# Altium schematic sheet Power.SchDoc
size A3; SheetNumber: 4; SheetTotal: 7
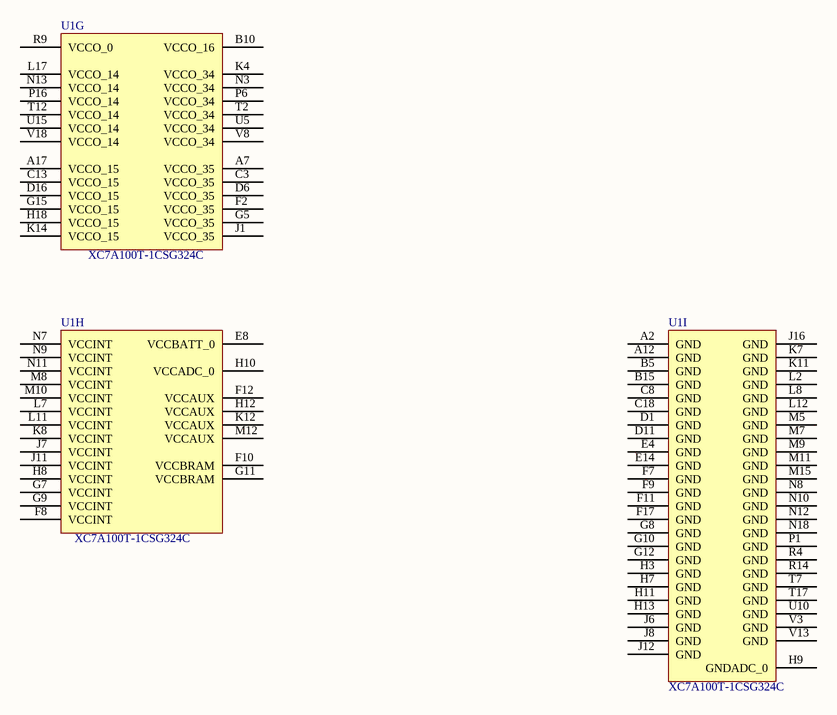
[diagram p0: Power.SchDoc]

## Parts
U1  XC7A100T-1CSG324C  [CSG324]  (parts G,H,I of 9)

## Nets

Not connected (* = marked no-connect by the designer): U1 A2(GND) A7(VCCO_35) A12(GND) A17(VCCO_15) B5(GND) B10(VCCO_16) B15(GND) C3(VCCO_35) C8(GND) C13(VCCO_15) C18(GND) D1(GND) D6(VCCO_35) D11(GND) D16(VCCO_15) E4(GND) E8(VCCBATT_0) E14(GND) F2(VCCO_35) F7(GND) F8(VCCINT) F9(GND) F10(VCCBRAM) F11(GND) F12(VCCAUX) F17(GND) G5(VCCO_35) G7(VCCINT) G8(GND) G9(VCCINT) G10(GND) G11(VCCBRAM) G12(GND) G15(VCCO_15) H3(GND) H7(GND) H8(VCCINT) H9(GNDADC_0) H10(VCCADC_0) H11(GND) H12(VCCAUX) H13(GND) H18(VCCO_15) J1(VCCO_35) J6(GND) J7(VCCINT) J8(GND) J11(VCCINT) J12(GND) J16(GND) K4(VCCO_34) K7(GND) K8(VCCINT) K11(GND) K12(VCCAUX) K14(VCCO_15) L2(GND) L7(VCCINT) L8(GND) L11(VCCINT) L12(GND) L17(VCCO_14) M5(GND) M7(GND) M8(VCCINT) M9(GND) M10(VCCINT) M11(GND) M12(VCCAUX) M15(GND) N3(VCCO_34) N7(VCCINT) N8(GND) N9(VCCINT) N10(GND) N11(VCCINT) N12(GND) N13(VCCO_14) N18(GND) P1(GND) P6(VCCO_34) P16(VCCO_14) R4(GND) R9(VCCO_0) R14(GND) T2(VCCO_34) T7(GND) T12(VCCO_14) T17(GND) U5(VCCO_34) U10(GND) U15(VCCO_14) V3(GND) V8(VCCO_34) V13(GND) V18(VCCO_14)

## Library data of the parts
U1 = CMP-016-00010-1: Field Programmable Gate Array, 7925 CLBs, 1098MHz, 101440-Cell, PBGA324; Nominal Supply Voltage: 1V; Package Body Material: Plastic; Min Supply Voltage: 950mV; Max Supply Voltage: 1.05V; Number of Outputs: 210; Number of Logic Elements/Cells: 101440; Clock Frequency: 1.098GHz; Qualification Status: Not Qualified; Number of CLBs: 7925; Combinatorial Delay of a CLB-Max: 1.27ns; Terminal Finish: Copper; Moisture Sensitivity Level: 3; Terminal Position: BOTTOM; Max Operating Temperature: 85°C; Pins: 324; Case/Package: LFBGA; Number of Inputs: 210; Power Supplies: 1V; Height - Seated (Max): 1.5mm; Surface Mount: Yes; Package Style: GRID ARRAY, LOW PROFILE, FINE PITCHMeter; JESD-609 Code: e1; Reach SVHC Compliant: Yes; Programmable Logic Type: FIELD PROGRAMMABLE GATE ARRAY; Terminal Pitch: 0.8mm; Package Shape: Square; Width: 15mm; Terminal Form: Ball; Length: 15mm; RoHS Compliant: Yes; Temperature Grade: OTHER; Technology: CMOS; Min Operating Temperature: 0°C